# EAGLE design iPlug (EAGLE 7.7.0)
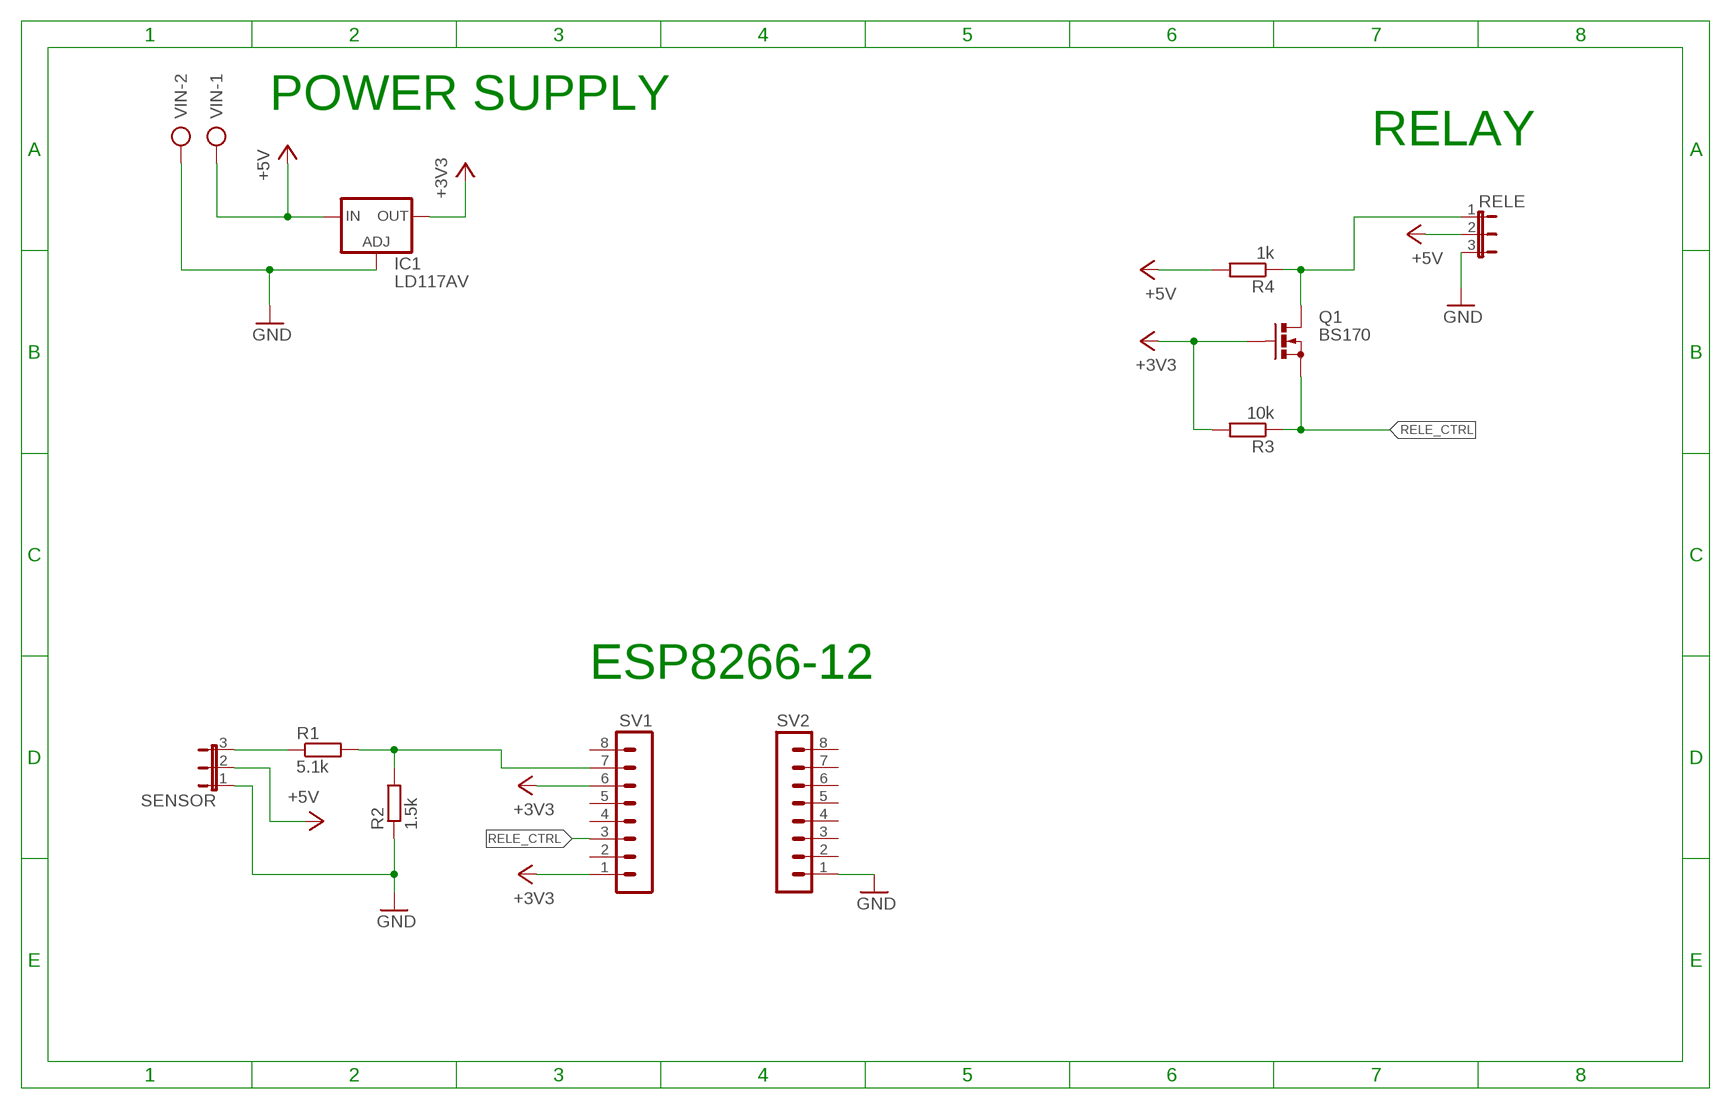
[diagram p0: schematic, sheet 1]

## Parts
IC1  LD117AV  [TO220L1]
Q1  BS170  [SOT54E]
R1  5.1k  R-EU_0207/10  [0207/10]
R2  1.5k  R-EU_0207/10  [0207/10]
R3  10k  R-EU_0207/10  [0207/10]
R4  1k  R-EU_0207/10  [0207/10]
RELE  JP2E  [JP2]
SENSOR  JP2E  [JP2]
SV1  MA08-1  [MA08-1]
SV2  MA08-1  [MA08-1]
VIN  AK500/2  [AK500/2]

## Nets
+3V3: IC1.2(OUT) Q1.G R3.2 SV1.1 SV1.6
+5V: IC1.3(IN) R4.2 RELE.2 SENSOR.2 VIN.1
GND: IC1.1(ADJ) R2.1 RELE.3 SENSOR.1 SV2.1 VIN.2
N$1: R1.2 R2.2 SV1.7
N$2: R1.1 SENSOR.3
N$3: Q1.D R4.1 RELE.1
RELE_CTRL: Q1.S R3.1 SV1.3
Unconnected: SV1.2 SV1.4 SV1.5 SV1.8 SV2.2 SV2.3 SV2.4 SV2.5 SV2.6 SV2.7 SV2.8

## Notes on the sheet
- POWER SUPPLY
- RELAY
- ESP8266-12

## Library data of the parts
IC1 = v-reg:LD117A?*: Low drop fixed and adjustable positive voltage regulators 1 A Source: http://www.st.com/stonline/products/literature/ds/7194/ld1117axx.pdf
Q1 = transistor-small-signal:BS170: N-CHANNEL MOS FET
R1-R4 = resistor:R-EU_: RESISTOR, European symbol
RELE SENSOR = jumper:JP2E: JUMPER
SV1 SV2 = con-lstb:MA08-1: PIN HEADER; OC_FARNELL: unknown; OC_NEWARK: unknown
VIN = con-ptr500:AK500/2: CONNECTOR; OC_FARNELL: unknown; OC_NEWARK: unknown

## Net classes
0 default: width 0.056 mm

## Board
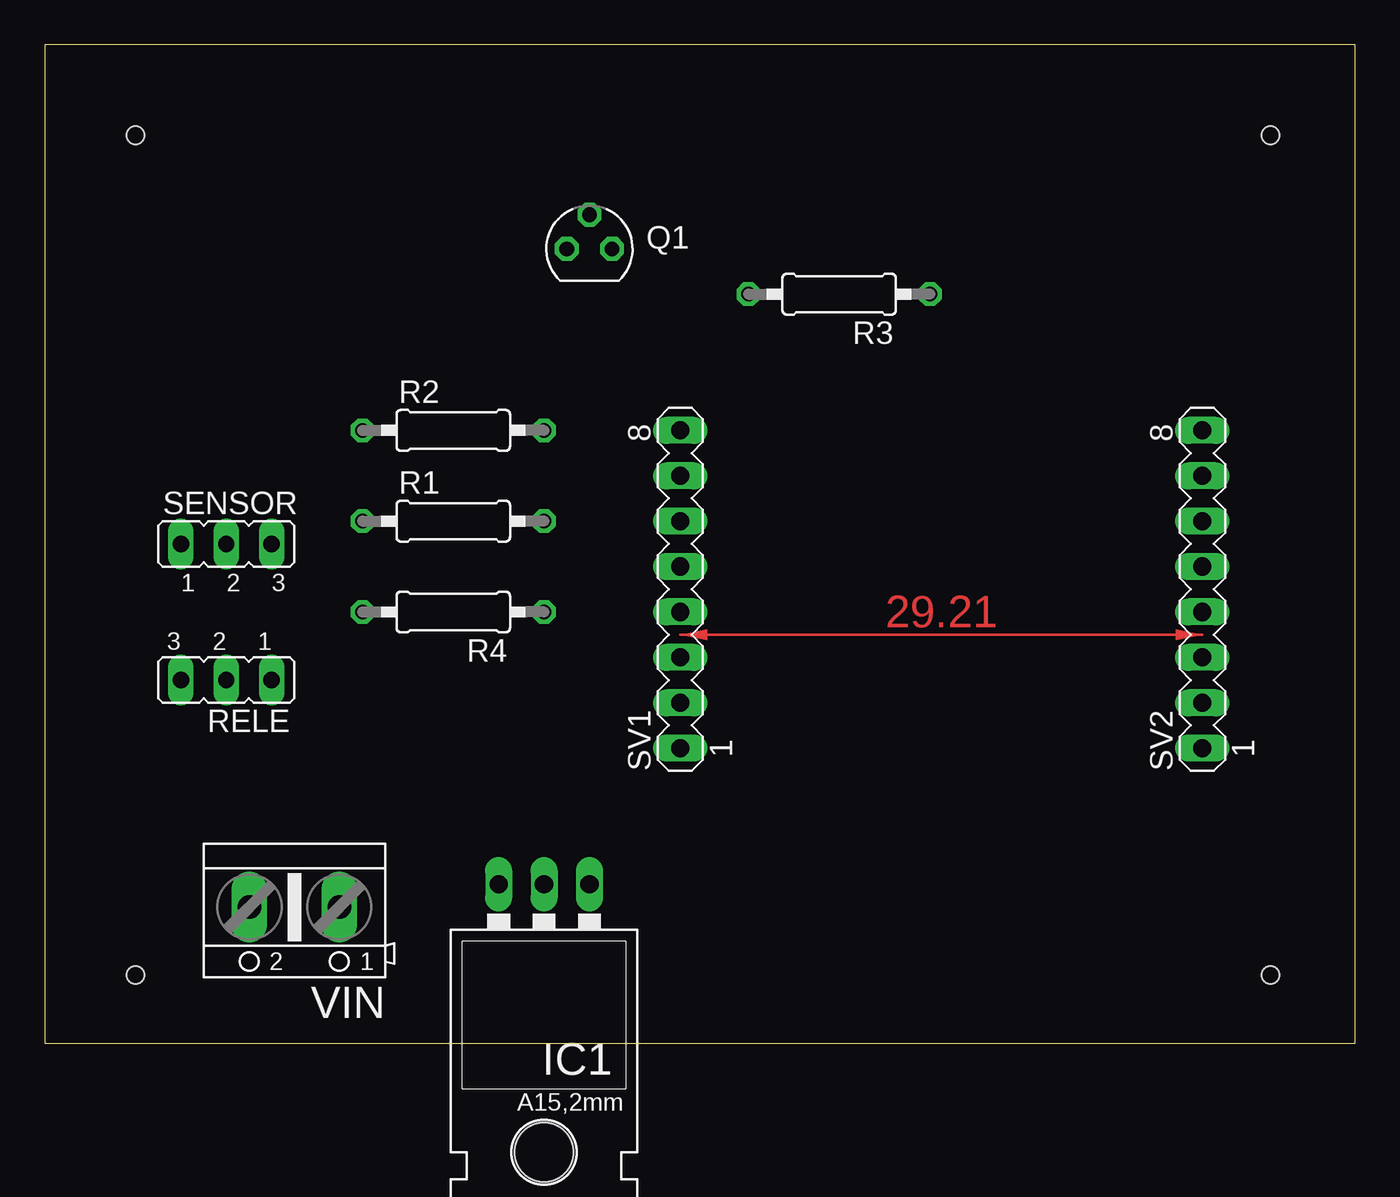
[diagram p1: board, top side]
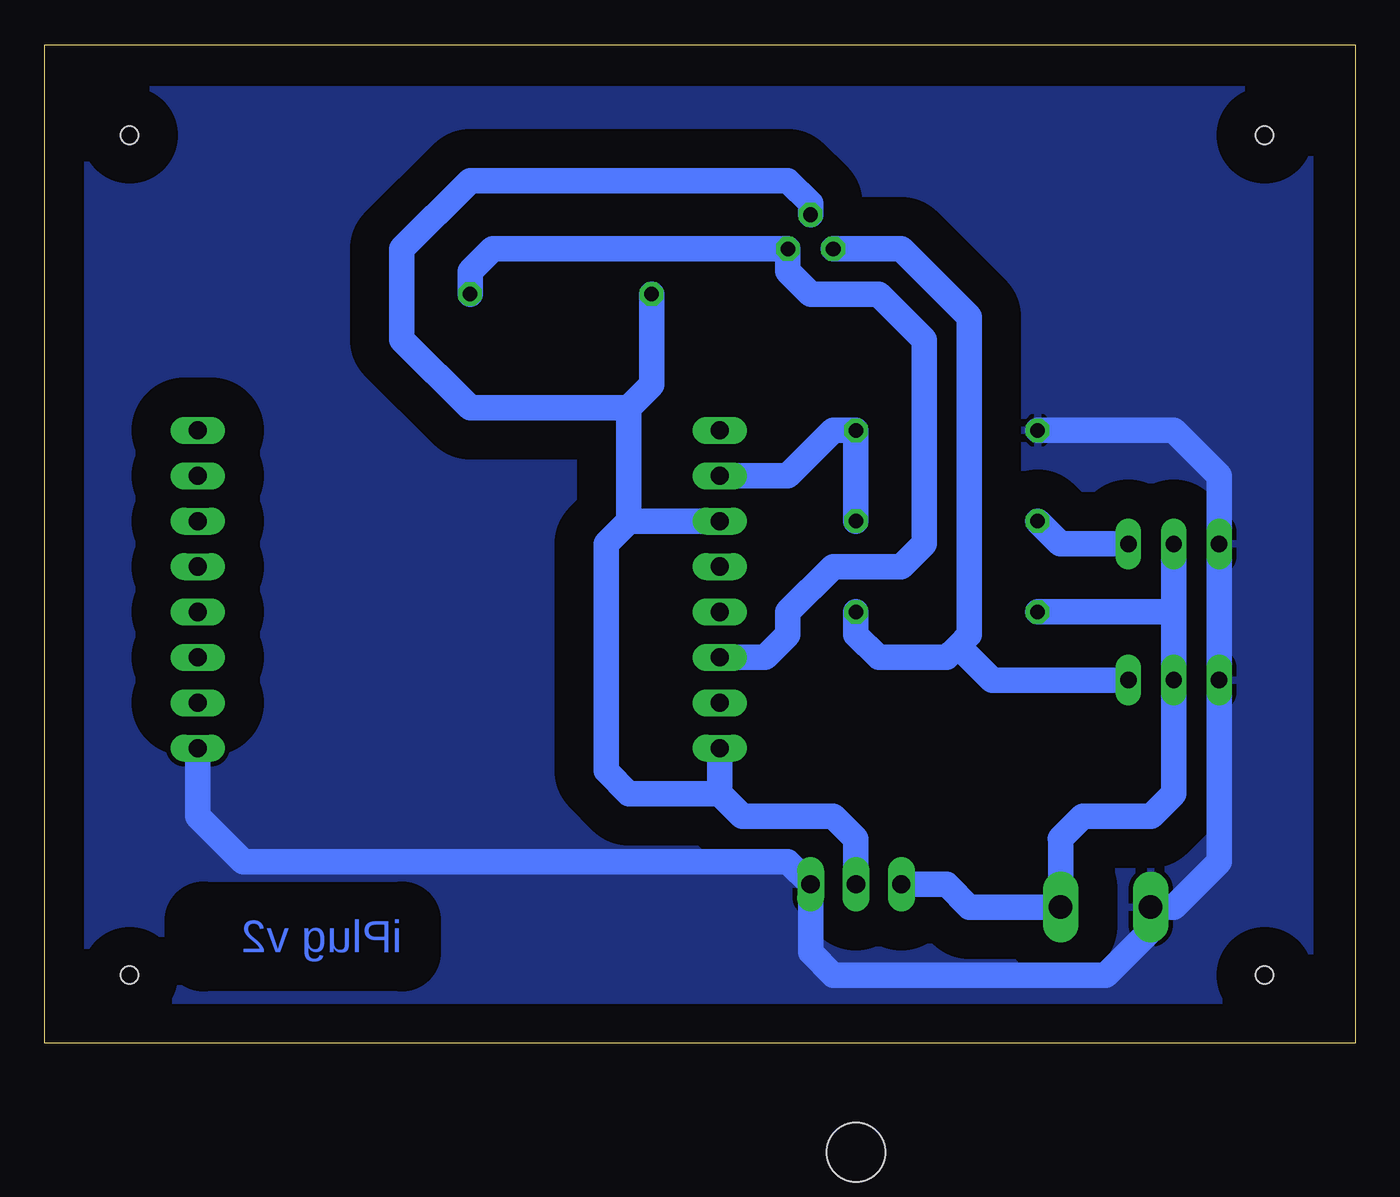
[diagram p2: board, bottom side, seen from below]

Size 73.33 x 55.87 mm. Coordinates in mm from the lower left corner, seen from the top.
Outline: 0,0 73.33,0 73.33,55.87 0,55.87 0,0
Copper layers (1*16): Top 0.035mm / dielectric 1.5mm / Bottom 0.035mm
Design rules "default": minimum track width 10mil, minimum drill 24mil, track to track 8mil, track to pad 8mil, pad to pad 8mil, via to via 8mil, smd to smd 8mil, copper to edge 40mil, drill to drill 8mil, minimum pad ring 10mil, minimum via ring 8mil, stop-mask expansion 4mil, vias tented up to drill 0mil, thermal gap 10mil
Holes 1 mm at 5.08,50.8 68.58,50.8 68.58,3.81 5.08,3.81

### Footprints (pad centres in the part's own frame; a part is rotated, then mirrored left to right if it is on the bottom)
TO220L1 = drill 1.016 long: 1 -2.54,-3.81; 2 0,-3.81; 3 2.54,-3.81 | hole 3.302: 0,11.176
SOT54E = drill 0.813 octagon: D -1.27,0; G 0,1.905; S 1.27,0
0207/10 = drill 0.813 octagon: 1 -5.08,0; 2 5.08,0
JP2 = drill 0.914 long: 1 -2.54,0; 2 0,0; 3 2.54,0
MA08-1 = drill 1.016 long: 1 -8.89,0; 2 -6.35,0; 3 -3.81,0; 4 -1.27,0; 5 1.27,0; 6 3.81,0; 7 6.35,0; 8 8.89,0
AK500/2 = drill 1.321 long: 1 -2.515,0; 2 2.515,0

### Placement (x,y rotation side)
IC1  27.94,5.08 180 top
Q1  30.48,44.45 0 top
R1  22.86,29.21 0 top
R2  22.86,34.29 0 top
R3  44.45,41.91 180 top
R4  22.86,24.13 180 top
RELE  10.16,20.32 180 top
SENSOR  10.16,27.94 0 top
SV1  35.56,25.4 90 top
SV2  64.77,25.4 90 top
VIN  13.97,7.62 180 top

### Tracks (layer width: path | path; a pad name or v marks a point on that pad's centre or on a via)
+3V3
  Bottom 1.422: IC1.2 27.94,11.43 29.21,12.7 34.29,12.7 35.56,13.97 | 35.56,13.97 SV1.1 | SV1.6 40.64,29.21 | 40.64,29.21 41.91,27.94 41.91,15.24 40.64,13.97 35.56,13.97 | R3.2 39.37,36.83 40.64,35.56 | 40.64,35.56 40.64,29.21 | Q1.G 30.48,46.99 31.75,48.26 49.53,48.26 53.34,44.45 53.34,39.37 49.53,35.56 40.64,35.56
+5V
  Bottom 1.422: SENSOR.2 10.16,24.13 | 10.16,24.13 RELE.2 10.16,13.97 11.43,12.7 15.24,12.7 16.51,11.43 16.48,11.4 VIN.1 21.59,7.62 22.86,8.89 IC1.3 | R4.2 10.16,24.13
GND
  Bottom 1.422: SV2.1 64.77,12.7 62.23,10.16 31.75,10.16 IC1.1 30.48,5.08 29.21,3.81 13.97,3.81 11.46,6.33 VIN.2 10.16,7.62 7.62,10.16 RELE.3 SENSOR.1 7.62,31.75 10.16,34.29 R2.1
  pour Bottom (isolate 2.184): 2.54,53.34 2.54,1.27 71.12,1.27 71.12,53.34
N$1
  Bottom 1.422: R1.2 R2.2 29.21,34.29 31.75,31.75 SV1.7
N$2
  Bottom 1.422: SENSOR.3 16.51,27.94 R1.1
N$3
  Bottom 1.422: Q1.D 25.4,44.45 21.59,40.64 21.59,22.86 22.23,22.23 | 22.23,22.23 22.86,21.59 26.67,21.59 27.94,22.86 R4.1 | RELE.1 20.32,20.32 22.23,22.23
RELE_CTRL
  Bottom 1.422: SV1.3 33.02,21.59 31.75,22.86 31.75,24.13 29.21,26.67 25.4,26.67 24.13,27.94 24.13,39.37 26.67,41.91 30.48,41.91 31.75,43.18 Q1.S 48.26,44.45 49.53,43.18 R3.1
(copper drawn outside any net)
  shapes: Top area x1

### Text on the board
Bottom: iPlug v2